# EasyEDA schematic schematic.json
TITLE: Ghostkey; REV: 1.0; Date: 2024-06-26; Sheet: 1/1; Company: None
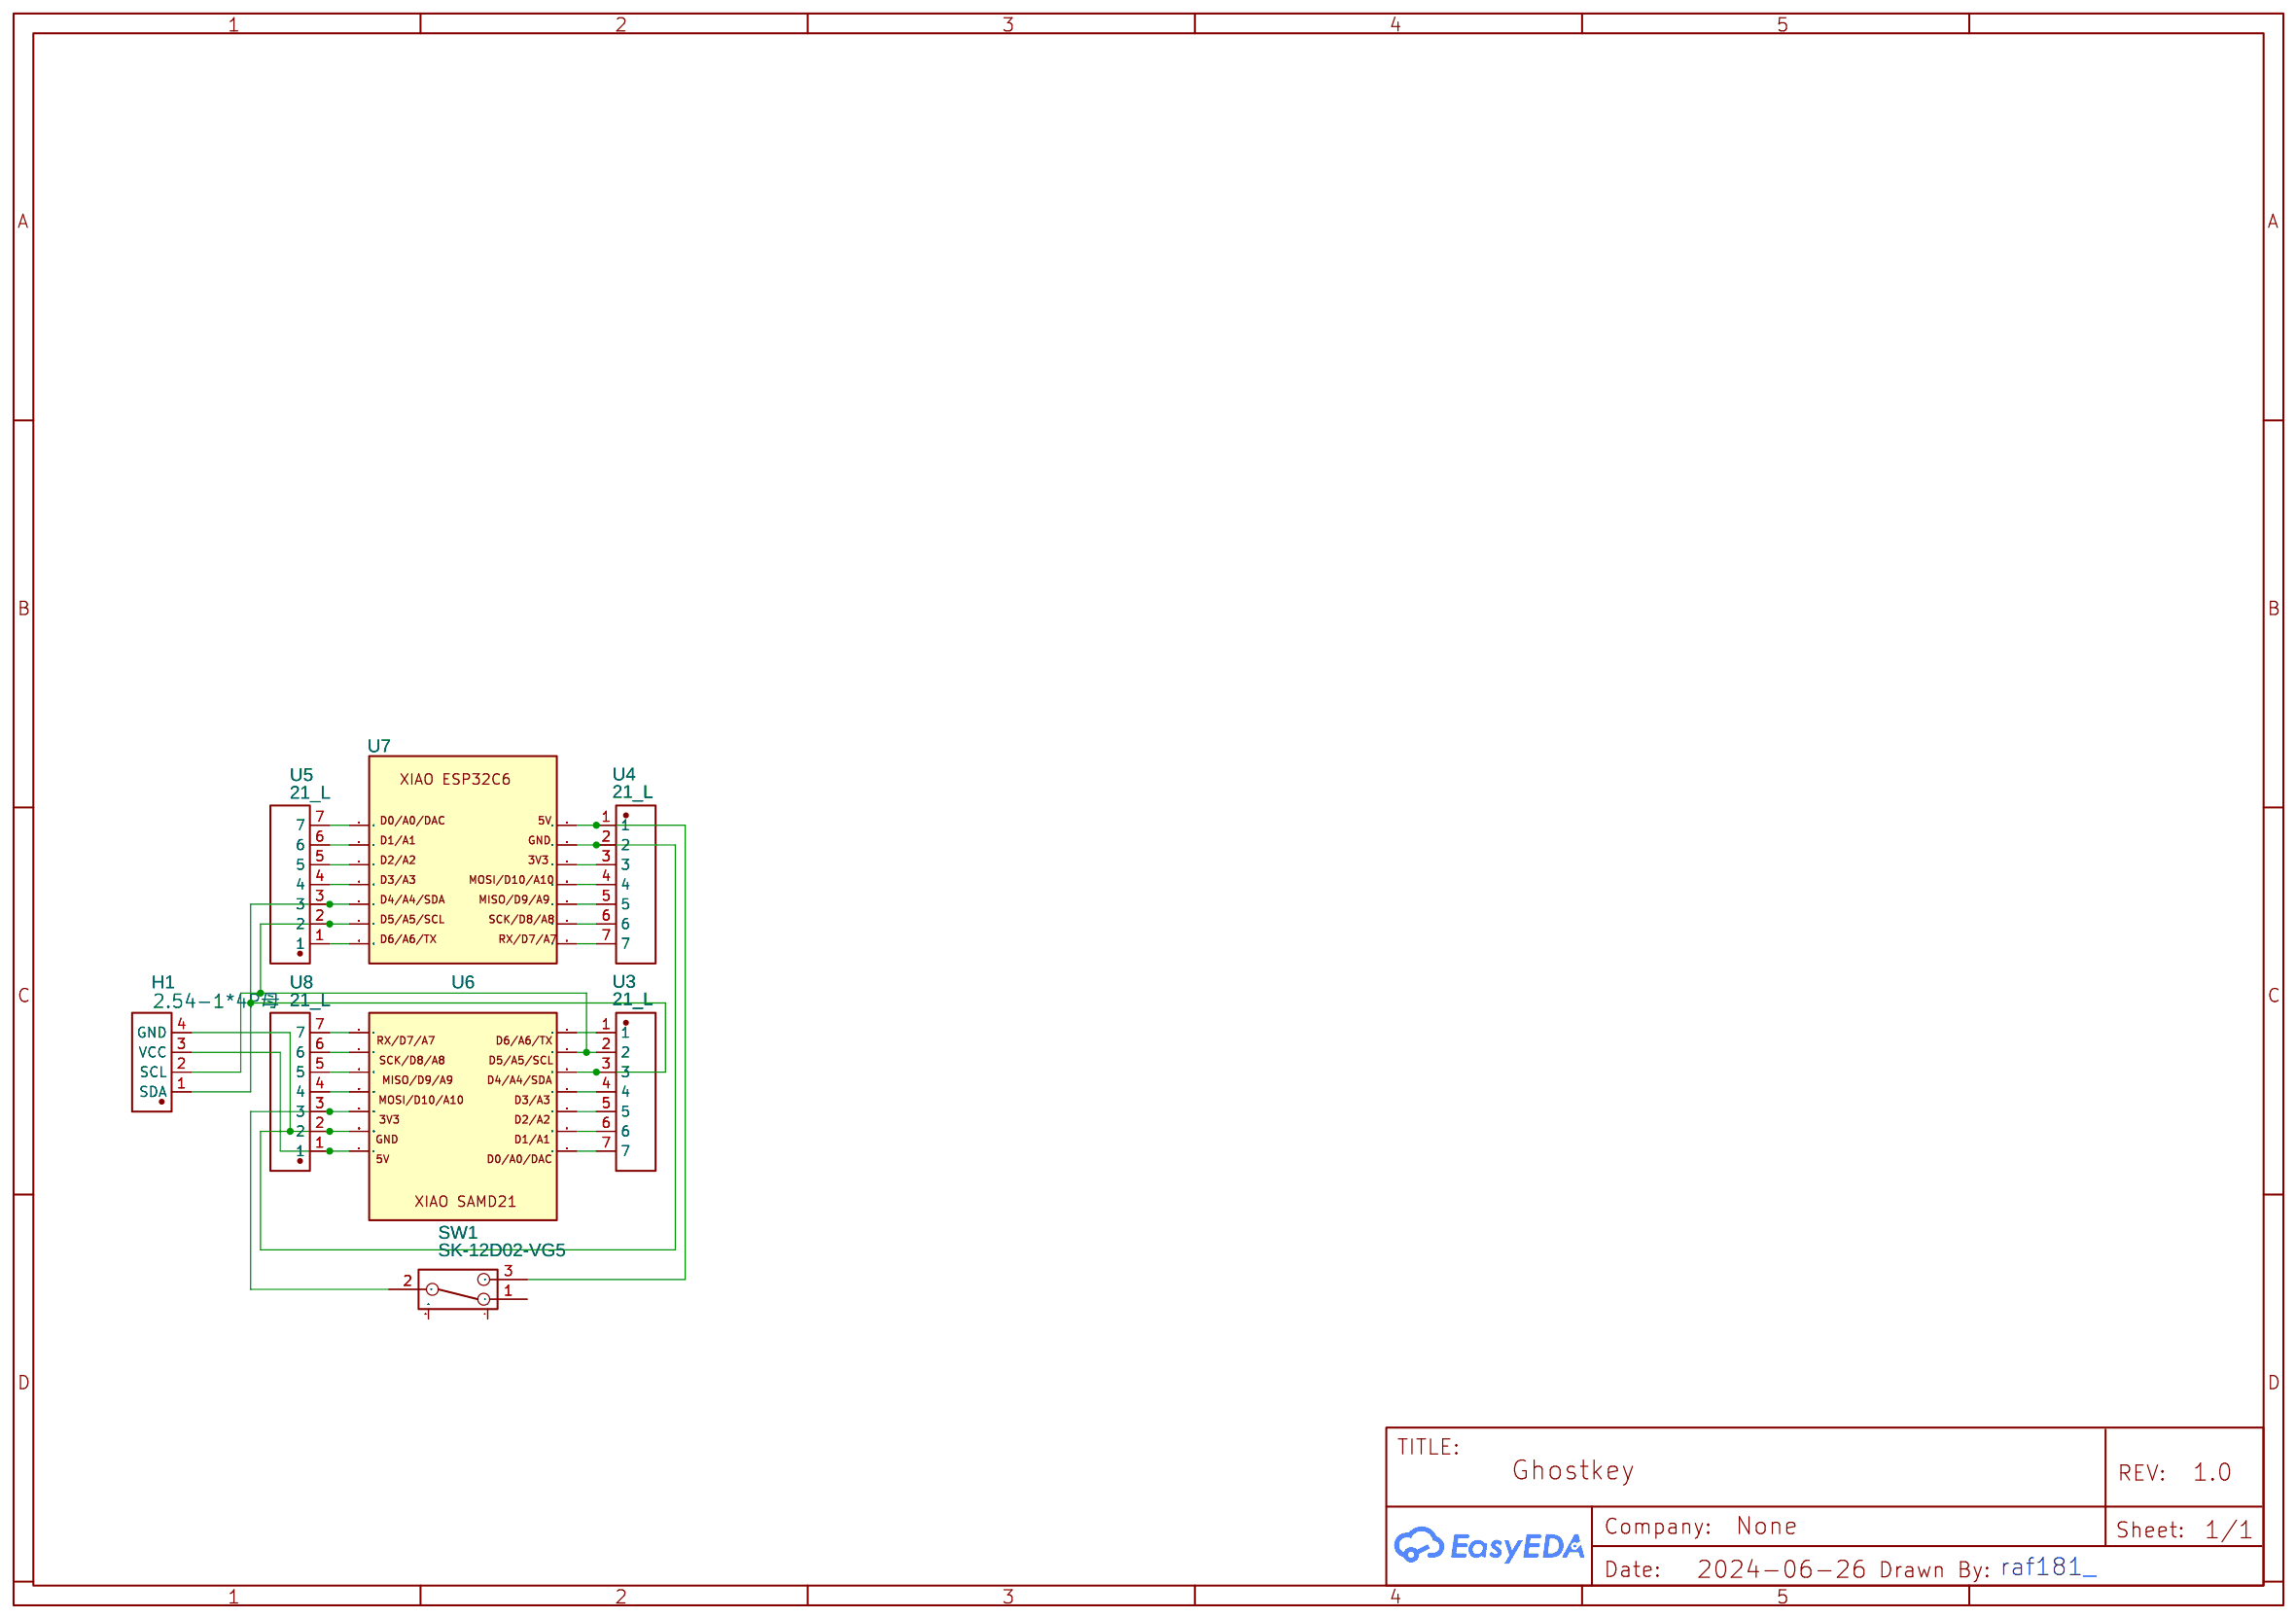
[diagram p0: schematic sheet]

## Parts
H1  2.54-1*4P母  [HDR-TH_4P-P2.54-V-F]
SW1  SK-12D02-VG5  [SW-TH_SK-12D02VG3]
U3  21_L  [HDR-TH_7P-P2.54-V-M]
U4  21_L  [HDR-TH_7P-P2.54-V-M]
U5  21_L  [HDR-TH_7P-P2.54-V-M]
U6  SEEEDUINO  XIAO  [SEEEDUINO_XIAO]
U7  SEEEDUINO  XIAO  [SEEEDUINO_XIAO]
U8  21_L  [HDR-TH_7P-P2.54-V-M]

## Library data of the parts
H1 = 2.54-1*4P母: Contributor: LCSC; Supplier: LCSC; Supplier Part: C2718488; Manufacturer: BOOMELE(博穆精密); JLCPCB Part Class: Extended Part
SW1 = SK-12D02-VG5: Supplier: LCSC; Supplier Part: C136722; Manufacturer: 韩国韩荣; Contributor: LCSC
U3-U5 U8 = HB-PH3-25417PB2GOP: Contributor: lcsc; Supplier: LCSC; Supplier Part: C6332200; Manufacturer: HANBO(汉博); JLCPCB Part Class: Extended Part
U6 U7 = SEEEDUINO  XIAO: Contributor: adrirobot; Supplier Part: 713-102010328; Supplier: Mouser; Manufacturer Part: 102010328; Manufacturer: Seeed Studio

## Nets
Net-(H1-1): H1.1(SDA) U3.3 U5.3 U6.D4 U7.D4
Net-(H1-2): H1.2(SCL) U3.2 U5.2 U6.D5 U7.D5
Net-(H1-3): H1.3(VCC) U6.5V U8.1
Net-(H1-4): H1.4(GND) U4.2 U6.GND U7.GND U8.2
Net-(SW1-2): SW1.2 U6.3V3 U8.3
Net-(SW1-3): SW1.3 U4.1 U7.5V
Net-(U3-1): U3.1 U6.D6
Net-(U3-4): U3.4 U6.D3
Net-(U3-5): U3.5 U6.D2
Net-(U3-6): U3.6 U6.D1
Net-(U3-7): U3.7 U6.D0
Net-(U4-3): U4.3 U7.3V3
Net-(U4-4): U4.4 U7.D10
Net-(U4-5): U4.5 U7.D9
Net-(U4-6): U4.6 U7.D8
Net-(U4-7): U4.7 U7.D7
Net-(U5-1): U5.1 U7.D6
Net-(U5-4): U5.4 U7.D3
Net-(U5-5): U5.5 U7.D2
Net-(U5-6): U5.6 U7.D1
Net-(U5-7): U5.7 U7.D0
Net-(U6-D7): U6.D7 U8.7
Net-(U6-D8): U6.D8 U8.6
Net-(U6-D9): U6.D9 U8.5
Net-(U6-D10): U6.D10 U8.4

Not connected (* = marked no-connect by the designer): SW1 1 4 5

## Notes on the sheet
- raf181_
